# EAGLE design uv-dosimeter-guva-op-amp-mk-1.4 (EAGLE 7.5.0)
AUTHOR: sean@yak.net
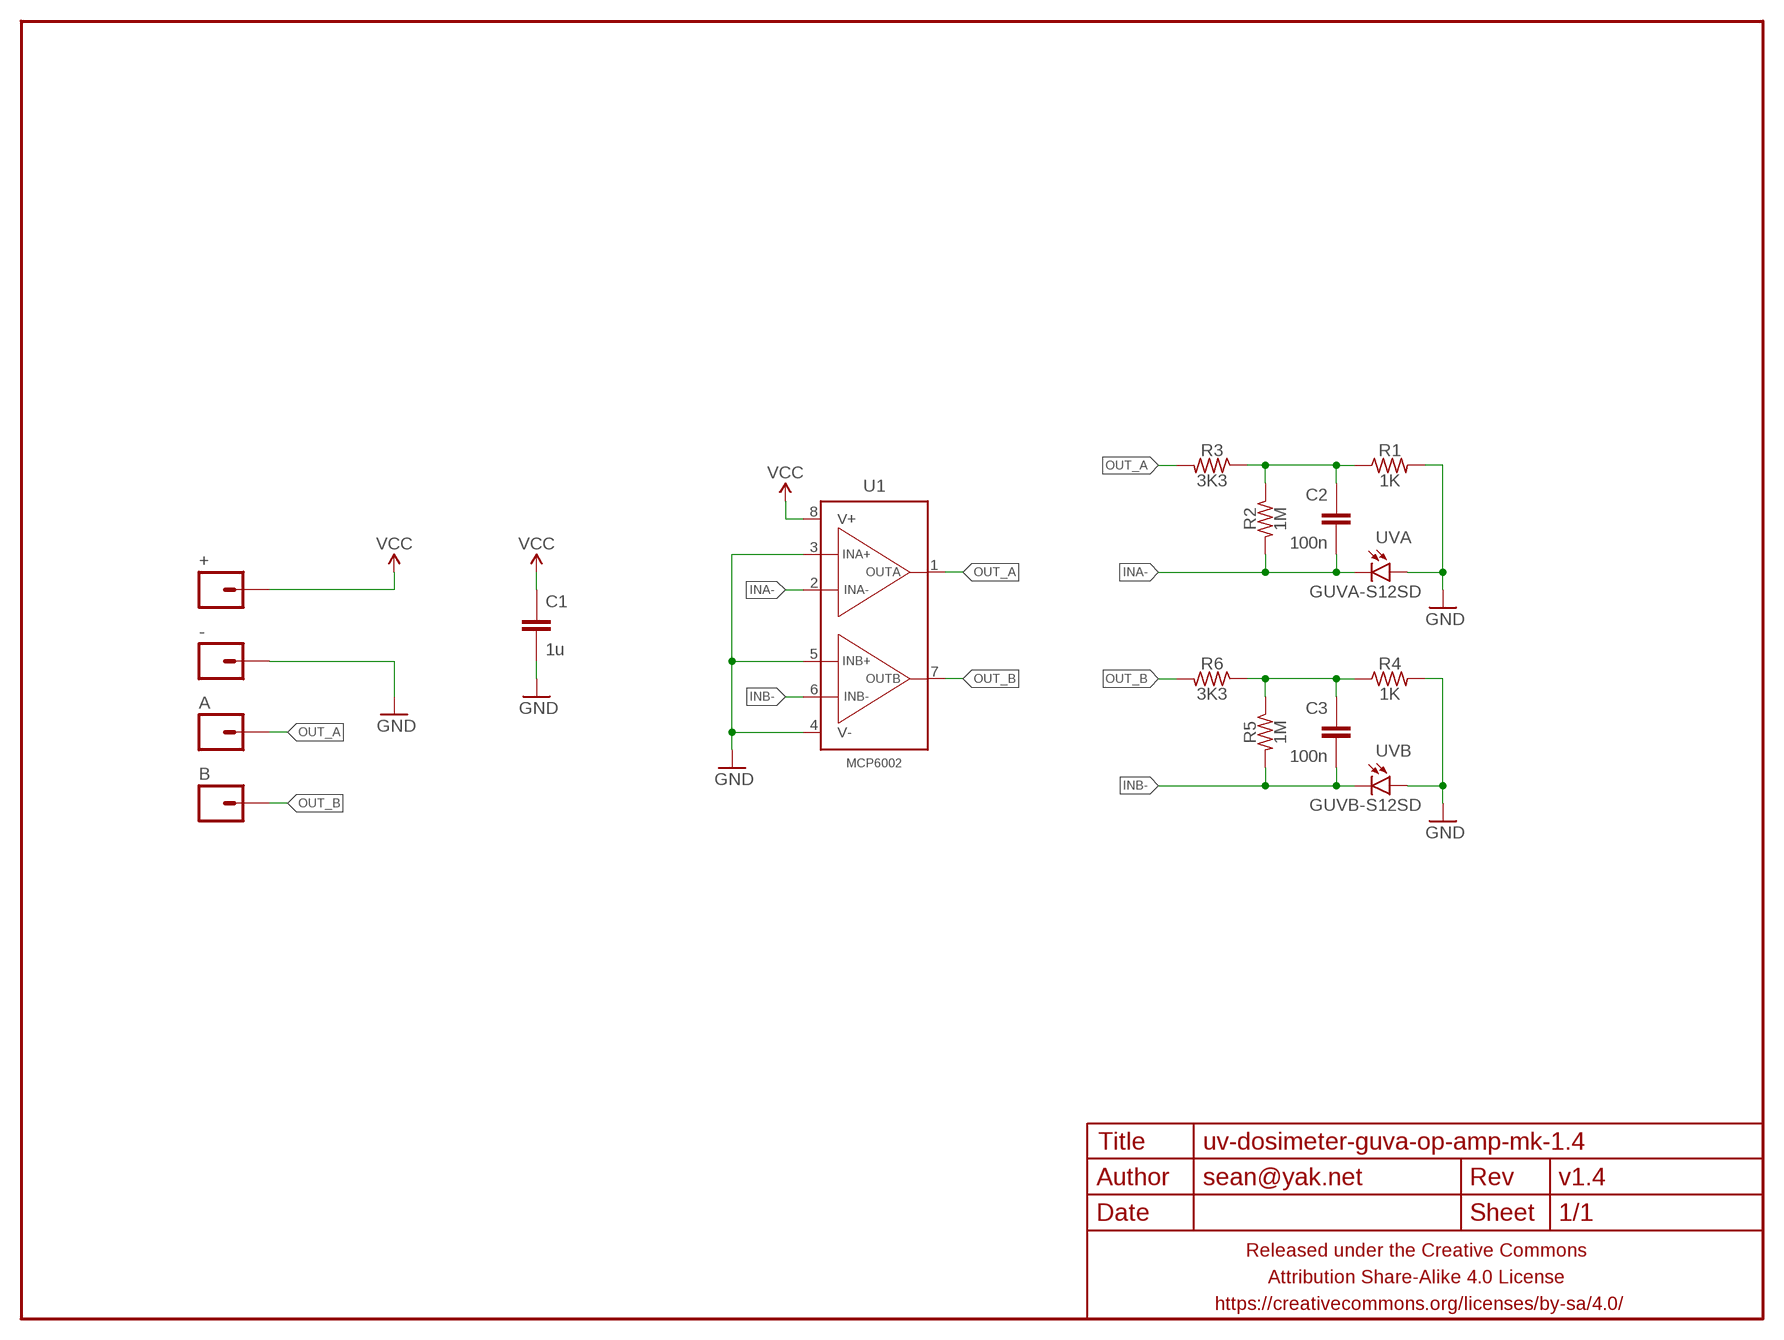
[diagram p0: schematic, sheet 1]

## Parts
+  M01PTH  [1X01]
-  M01PTH  [1X01]
A  M01PTH  [1X01]
B  M01PTH  [1X01]
C1  1u  CAPACITOR-CERAMICC0603  [C0603]
C2  100n  CAPACITOR-CERAMICC0603  [C0603]
C3  100n  CAPACITOR-CERAMICC0603  [C0603]
FRAME1  FRAME-LETTERNO_PACKAGE  [DUMMY]
R1  1K  RESISTORR0603  [R0603]
R2  1M  RESISTORR0603  [R0603]
R3  3K3  RESISTORR0603  [R0603]
R4  1K  RESISTORR0603  [R0603]
R5  1M  RESISTORR0603  [R0603]
R6  3K3  RESISTORR0603  [R0603]
U1  MCP6002  MCP6002SOIC  [SO08]
UVA  GUVA-S12SD  GUVA-S12SDLED3528  [LED3528]
UVB  GUVB-S12SD  GUVA-S12SDLED3528  [LED3528]

## Nets
GND: -.1 C1.2 R1.2 R4.2 U1.3(INA+) U1.4(V-) U1.5(INB+) UVA.A UVB.A
INA-: C2.2 R2.2 U1.2(INA-) UVA.K(C)
INB-: C3.2 R5.2 U1.6(INB-) UVB.K(C)
N$2: C2.1 R1.1 R2.1 R3.1
N$4: C3.1 R4.1 R5.1 R6.1
OUT_A: A.1 R3.2 U1.1(OUTA)
OUT_B: B.1 R6.2 U1.7(OUTB)
VCC: +.1 C1.1 U1.8(V+)

## Library data of the parts
+ - A B = a_parts:M01: Header 1 Standard 1-pin 0.1" header. Use with straight break away headers (SKU : PRT-00116), right angle break away headers (PRT-00553), swiss pins (PRT-00743), machine pins (PRT-00117), and female headers (PRT-00115).
C1-C3 = a_parts:CAPACITOR-CERAMIC: CAPACITOR, European symbol
FRAME1 = A_butts:FRAME-LETTER: Schematic Frame Standard 8.5x11 US Letter frame; DESIGNER: sean@yak.net; VERSION: v1.4
R1-R6 = a_parts:RESISTOR: RESISTOR, American symbol
U1 = a_parts:MCP6002
UVA UVB = a_parts:GUVA-S12SD

## Board
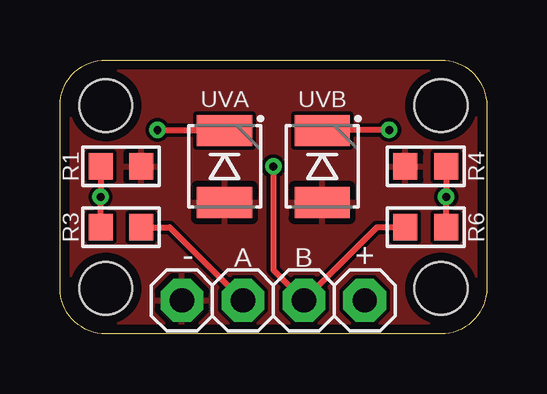
[diagram p1: board, top side]
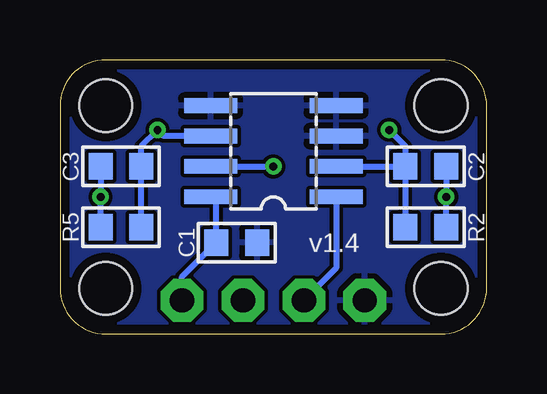
[diagram p2: board, bottom side, seen from below]

Size 17.78 x 11.43 mm. Coordinates in mm from the lower left corner, seen from the top.
Outline: 17.78,9.53 17.78,1.91 arc-90 15.88,0 1.91,0 arc-90 0,1.91 0,9.53 arc-90 1.91,11.43 15.88,11.43 arc-90 17.78,9.53
Copper layers (1*16): Top 0.0356mm / dielectric 1.5011mm / Bottom 0.0356mm
Design rules "LaenPCBOrder_2": minimum track width 6mil, minimum drill 13mil, track to track 6mil, track to pad 6mil, pad to pad 6mil, via to via 6mil, smd to smd 6mil, copper to edge 15mil, drill to drill 6mil, minimum pad ring 7mil, minimum via ring 7mil, stop-mask expansion 3mil, vias tented up to drill 20mil, thermal gap 10mil
Holes 2.2 mm at 1.91,9.53 15.88,9.53 1.91,1.91 15.88,1.91

### Footprints (pad centres in the part's own frame; a part is rotated, then mirrored left to right if it is on the bottom)
1X01 = drill 1.016 pad 1.778 octagon: 1 0,0
C0603 = smd 1 x 1.1: 1 -0.85,0; 2 0.85,0
R0603 = smd 1 x 1.1: 1 -0.85,0; 2 0.85,0
SO08 = smd 0.61 x 2.21: 1 -1.905,-2.616; 2 -0.635,-2.616; 3 0.635,-2.616; 4 1.905,-2.616; 5 1.905,2.616; 6 0.635,2.616; 7 -0.635,2.616; 8 -1.905,2.616
LED3528 = smd 2.3 x 1.3: A 0,-1.5; K 0,1.5

### Placement (x,y rotation side)
+  12.7,1.4 0 top
-  5.08,1.4 0 top
A  7.62,1.4 0 top
B  10.16,1.4 0 top
C1  10.41,3.81 0 bottom
C2  2.54,6.99 180 bottom
C3  15.24,6.99 0 bottom
FRAME1  0,0 90 bottom
R1  2.54,6.99 0 top
R2  2.54,4.45 180 bottom
R3  2.54,4.45 0 top
R4  15.24,6.99 180 top
R5  15.24,4.45 0 bottom
R6  15.24,4.45 180 top
U1  8.89,7.62 90 bottom
UVA  6.86,6.99 0 top
UVB  10.92,6.99 0 top

### Tracks (layer width: path | path; a pad name or v marks a point on that pad's centre or on a via)
GND
  pour Bottom (rank 6): 17.78,9.53 17.78,1.91 arc-90 15.88,0 1.91,0 arc-90 0,1.91 0,9.53 arc-90 1.91,11.43 15.88,11.43 arc-90
  pour Top: 17.78,9.53 17.78,1.91 arc-90 15.88,0 1.91,0 arc-90 0,1.91 0,9.53 arc-90 1.91,11.43 15.88,11.43 arc-90
INA-  (via drill 0.33)
  Top 0.254: v4.06,8.51 6.83,8.51 UVA.K
  Bottom 0.254: U1.2 C2.2 | C2.2 R2.2 | v4.06,8.51 3.39,7.83 C2.2
INB-  (via drill 0.33)
  Top 0.254: v13.72,8.51 10.95,8.51 UVB.K
  Bottom 0.254: R5.2 C3.2 14.39,7.83 v13.72,8.51 13.46,8.26 U1.6
N$2  (via drill 0.33)
  Top 0.254: R2.1 v1.69,5.71 R1.1
  Bottom 0.254: R2.1 v1.69,5.71 R1.1
N$4  (via drill 0.33)
  Top 0.254: R4.1 v16.09,5.71 R5.1
  Bottom 0.254: R4.1 v16.09,5.71 R5.1
OUT_A
  Top 0.254: R3.2 4.57,4.45 A.1
  Bottom 0.254: U1.1 6.27,2.74 A.1
OUT_B  (via drill 0.33)
  Top 0.254: v8.89,6.99 8.89,2.67 B.1 13.21,4.45 R6.2
  Bottom 0.254: U1.7 v8.89,6.99
VCC
  Bottom 0.254: +.1 12.7,2.37 C1.1 11.26,5.47 U1.8